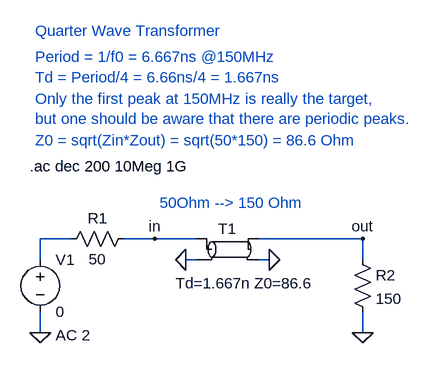
[diagram p0: schematic quarter_wave_transformer.asc]
quarter_wave_transformer.asc, the LTspice schematic file:
Version 4
SHEET 1 880 680
WIRE 0 128 -48 128
WIRE 128 128 80 128
WIRE 192 128 128 128
WIRE 448 128 288 128
WIRE -48 160 -48 128
WIRE 192 160 176 160
WIRE 304 160 288 160
WIRE 448 160 448 128
WIRE -48 272 -48 240
WIRE 448 272 448 240
FLAG 448 272 0
FLAG 176 160 0
FLAG 304 160 0
FLAG -48 272 0
FLAG 448 128 out
FLAG 128 128 in
SYMBOL res -16 144 R270
WINDOW 0 32 56 VTop 0
WINDOW 3 0 56 VBottom 0
SYMATTR InstName R1
SYMATTR Value 50
SYMBOL tline 240 144 R0
WINDOW 3 -80 52 Left 0
SYMATTR InstName T1
SYMATTR Value Td=1.667n Z0=86.6
SYMBOL res 432 144 R0
SYMATTR InstName R2
SYMATTR Value 150
SYMBOL voltage -48 144 R0
WINDOW 123 24 132 Left 0
WINDOW 39 0 0 Left 0
SYMATTR InstName V1
SYMATTR Value 0
SYMATTR Value2 AC 2
TEXT -64 16 Left 0 !.ac dec 200 10Meg 1G
TEXT -56 -192 Left 0 ;Quarter Wave Transformer
TEXT -56 -24 Left 0 ;Z0 = sqrt(Zin*Zout) = sqrt(50*150) = 86.6 Ohm
TEXT -56 -152 Left 0 ;Period = 1/f0 = 6.667ns @150MHz\nTd = Period/4 = 6.66ns/4 = 1.667ns
TEXT -56 -88 Left 0 ;Only the first peak at 150MHz is really the target,\nbut one should be aware that there are periodic peaks.
TEXT 136 72 Left 0 ;50Ohm --> 150 Ohm

The netlist it stands for:
* quarter_wave_transformer.asc
R1 N001 in 50
T1 in 0 out 0 Td=1.667n Z0=86.6
R2 out 0 150
V1 N001 0 0 AC 2
.ac dec 200 10Meg 1G
* Quarter Wave Transformer
* Z0 = sqrt(Zin*Zout) = sqrt(50*150) = 86.6 Ohm
* Period = 1/f0 = 6.667ns @150MHz
* Td = Period/4 = 6.66ns/4 = 1.667ns
* Only the first peak at 150MHz is really the target,
* but one should be aware that there are periodic peaks.
* 50Ohm --> 150 Ohm
.backanno
.end